# Altium project PCB_Project1.PrjPCB
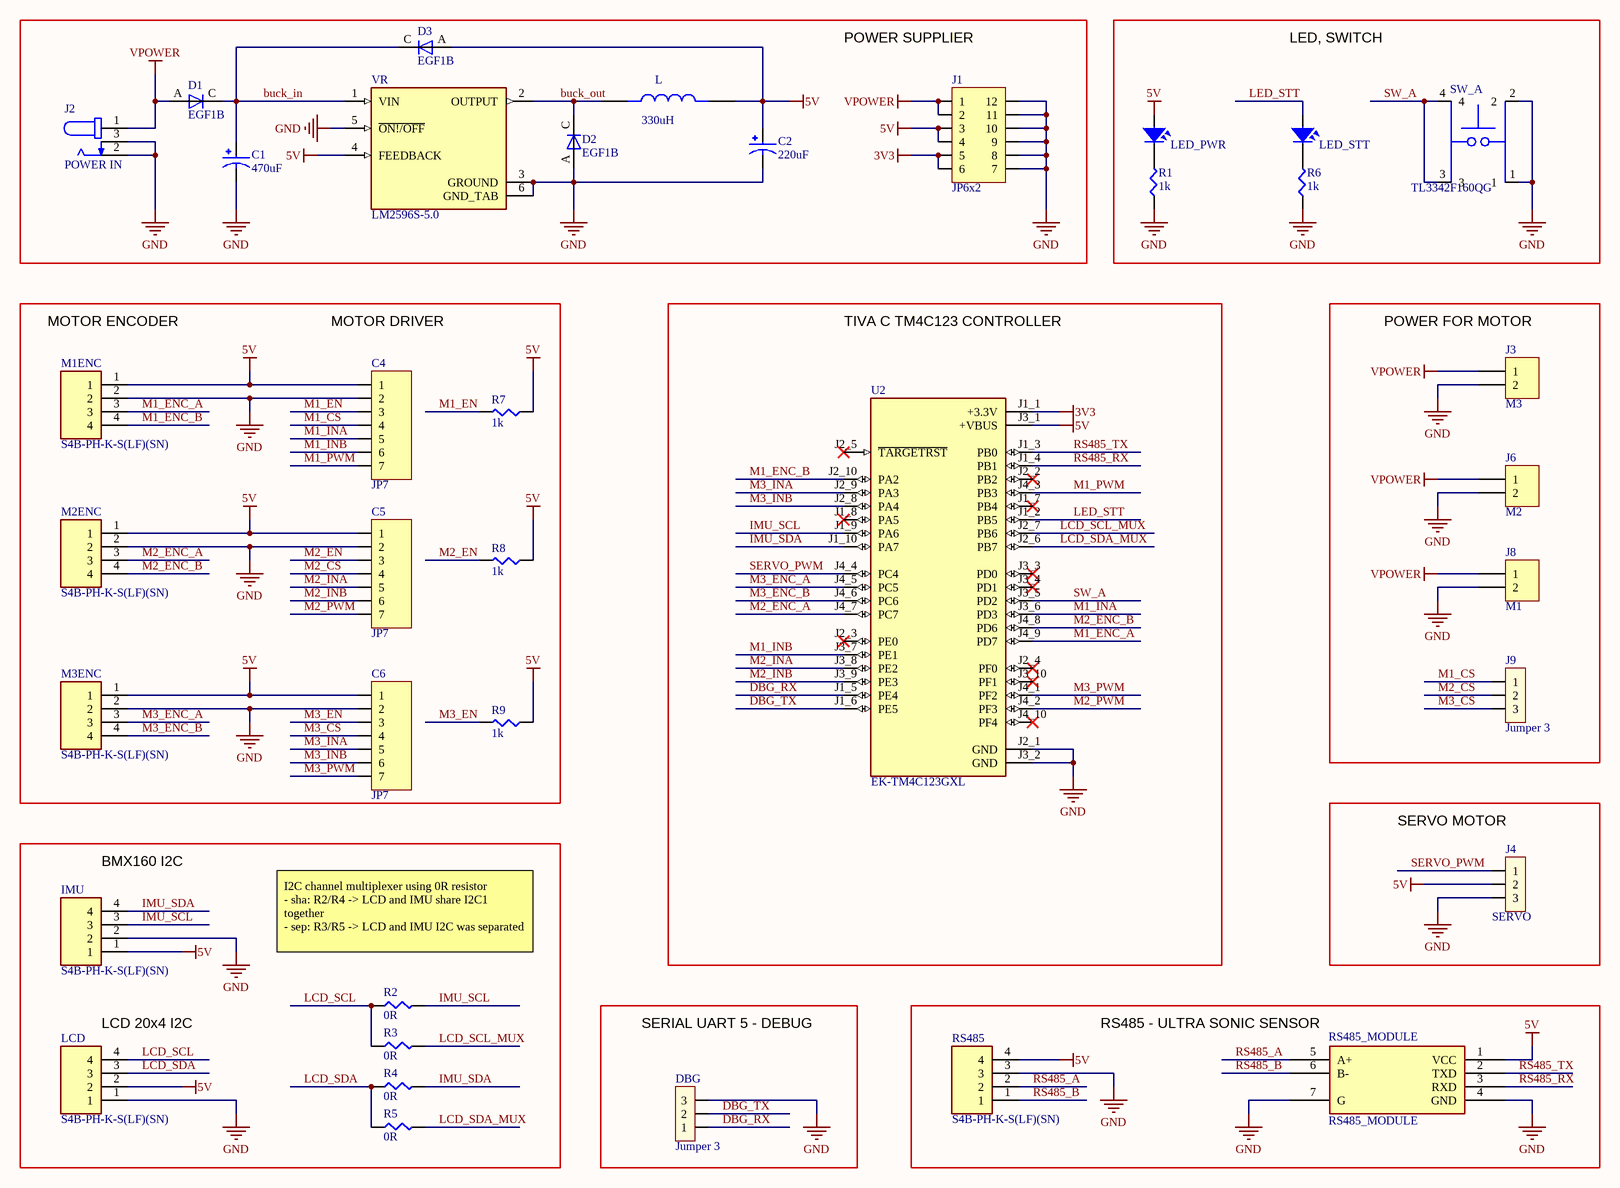
[diagram p0: Sheet1.SchDoc]
1 sheet, 38 parts. Net scope: global (net labels, ports and power ports of the same name join across sheets).
Board file: PCB1.PcbDoc

## Sheet Sheet1.SchDoc: Nexus Robot Controller board
size A3; Author: Khue HM; Address1: Version 1.1; Address2: Design by DPEE Lab; SheetNumber: 1; SheetTotal: 1

### Parts
C1  470uF  [CAP_EEE2AA220P]
C2  220uF  [CAP_EEEHB1V220P]
C4  JP7  [JP7-C1T]
C5  JP7  [JP7-C1T]
C6  JP7  [JP7-C1T]
D1  EGF1B  [DIOM449X264X300L114X135N]
D2  EGF1B  [DIOM449X264X300L114X135N]
D3  EGF1B  [DIOM449X264X300L114X135N]
DBG  Jumper 3  [JP3]
IMU  S4B-PH-K-S(LF)(SN)  [JST_S4B-PH-K-S(LF)(SN)]
J1  JP6x2  [JP6-D2T]
J2  POWER IN  [CUI_PJ-002B]
J3  M3  [KF2-3.5]
J4  SERVO  [JP3]
J6  M2  [KF2-3.5]
J8  M1  [KF2-3.5]
J9  Jumper 3  [JP3]
L  330uH  [IND_B1047AS-331M=P3]
LCD  S4B-PH-K-S(LF)(SN)  [JST_S4B-PH-K-S(LF)(SN)]
LED_PWR  PWR LED  [LED-0805-Green]  (value not drawn)
LED_STT  LED  [LED-0805-Green]  (value not drawn)
M1ENC  S4B-PH-K-S(LF)(SN)  [JST_S4B-PH-K-S(LF)(SN)]
M2ENC  S4B-PH-K-S(LF)(SN)  [JST_S4B-PH-K-S(LF)(SN)]
M3ENC  S4B-PH-K-S(LF)(SN)  [JST_S4B-PH-K-S(LF)(SN)]
R1  1k  [SMD-0805-RES]
R2  0R  [SMD-0805-RES]
R3  0R  [SMD-0805-RES]
R4  0R  [SMD-0805-RES]
R5  0R  [SMD-0805-RES]
R6  1k  [SMD-0805-RES]
R7  1k  [SMD-0805-RES]
R8  1k  [SMD-0805-RES]
R9  1k  [SMD-0805-RES]
RS485  S4B-PH-K-S(LF)(SN)  [JST_S4B-PH-K-S(LF)(SN)]
RS485_MODULE  RS485_MODULE  [RS485_MODULE]
SW_A  TL3342F160QG  [SW_TL3342F160QG]
U2  EK-TM4C123GXL  [MODULE_EK-TM4C123GXL]
VR  LM2596S-5.0  [TO170P1524X483-6N]

### Blocks framed on the sheet
POWER SUPPLIER: C1 C2 D1-D3 J1 J2 L VR
LED, SWITCH: LED_PWR LED_STT R1 R6 SW_A
TIVA C TM4C123 CONTROLLER: U2
POWER FOR MOTOR: J3 J6 J8 J9
SERVO MOTOR: J4
SERIAL UART 5 - DEBUG: DBG
RS485 - ULTRA SONIC SENSOR: RS485 RS485_MODULE

### Nets
3V3: J1.5 J1.6 U2.J1_1(+3.3V)
5V: C2.1 C4.1 C5.1 C6.1 D3.A IMU.1 J1.3 J1.4 J4.2 L.2 LCD.2 LED_PWR.1 M1ENC.1 M2ENC.1 M3ENC.1 R7.1 R8.1 R9.1 RS485.4 RS485_MODULE.1(VCC) U2.J3_1(+VBUS) VR.4(FEEDBACK)
GND: C1.2 C2.2 C4.2 C5.2 C6.2 D2.A DBG.3 IMU.2 J1.7 J1.8 J1.9 J1.10 J1.11 J1.12 J2.2 J2.3 J3.2 J4.3 J6.2 J8.2 LCD.1 M1ENC.2 M2ENC.2 M3ENC.2 R1.1 R6.1 RS485.3 RS485_MODULE.4(GND) RS485_MODULE.7(G) SW_A.1 SW_A.2 U2.J2_1(GND) U2.J3_2(GND) VR.3(GROUND) VR.5(~{ON!/OFF}) VR.6(GND_TAB)
VPOWER: D1.A J1.1 J1.2 J2.1 J3.1 J6.1 J8.1
buck_in: C1.1 D1.C D3.C VR.1(VIN)
buck_out: D2.C L.1 VR.2(OUTPUT)
DBG_RX: DBG.1 U2.J1_5(PE4)
DBG_TX: DBG.2 U2.J1_6(PE5)
IMU_SCL: IMU.3 R2.2 U2.J1_9(PA6)
IMU_SDA: IMU.4 R4.2 U2.J1_10(PA7)
LCD_SCL: LCD.4 R2.1 R3.1
LCD_SCL_MUX: R3.2 U2.J2_7(PB6)
LCD_SDA: LCD.3 R4.1 R5.1
LCD_SDA_MUX: R5.2 U2.J2_6(PB7)
LED_STT: LED_STT.1 U2.J1_2(PB5)
M1_CS: C4.4 J9.1
M1_EN: C4.3 R7.2
M1_ENC_A: M1ENC.3 U2.J4_9(PD7)
M1_ENC_B: M1ENC.4 U2.J2_10(PA2)
M1_INA: C4.5 U2.J3_6(PD3)
M1_INB: C4.6 U2.J3_7(PE1)
M1_PWM: C4.7 U2.J4_3(PB3)
M2_CS: C5.4 J9.2
M2_EN: C5.3 R8.2
M2_ENC_A: M2ENC.3 U2.J4_7(PC7)
M2_ENC_B: M2ENC.4 U2.J4_8(PD6)
M2_INA: C5.5 U2.J3_8(PE2)
M2_INB: C5.6 U2.J3_9(PE3)
M2_PWM: C5.7 U2.J4_2(PF3)
M3_CS: C6.4 J9.3
M3_EN: C6.3 R9.2
M3_ENC_A: M3ENC.3 U2.J4_5(PC5)
M3_ENC_B: M3ENC.4 U2.J4_6(PC6)
M3_INA: C6.5 U2.J2_9(PA3)
M3_INB: C6.6 U2.J2_8(PA4)
M3_PWM: C6.7 U2.J4_1(PF2)
RS485_A: RS485.2 RS485_MODULE.5(A+)
RS485_B: RS485.1 RS485_MODULE.6(B-)
RS485_RX: RS485_MODULE.3(RXD) U2.J1_4(PB1)
RS485_TX: RS485_MODULE.2(TXD) U2.J1_3(PB0)
SERVO_PWM: J4.1 U2.J4_4(PC4)
SW_A: SW_A.3 SW_A.4 U2.J3_5(PD2)
NetLED_PWR_2: LED_PWR.2 R1.2
NetLED_STT_2: LED_STT.2 R6.2

Not connected (* = marked no-connect by the designer): U2 J1_7(PB4)* J1_8(PA5)* J2_2(PB2)* J2_3(PE0)* J2_4(PF0)* J2_5(~{TARGETRST})* J3_3(PD0)* J3_4(PD1)* J3_10(PF1)* J4_10(PF4)*

### Notes on the sheet
- MOTOR ENCODER
- MOTOR DRIVER
- (near IMU) BMX160 I2C
- I2C channel multiplexer using 0R resistor
  - sha: R2/R4 -> LCD and IMU share I2C1 together
  - sep: R3/R5 -> LCD and IMU I2C was separated
- (near LCD) LCD 20x4 I2C
- Title
- Size:
- Date:
- A3
- Number:
- Time:
- Revision:
- Sheet
- of
- File:

### Library data of the parts
C1 = EEE2AA220P: Capacitor; Alum Electrolytic; Cap 22 uF; Tol 20%; Vol-Rtg 100 VDC; SMT; 10x10.5; TR; MF: Panasonic; MP: EEE-2AA220P; Availability: In Stock; Price: None; SnapEDA_Link: https://www.snapeda.com/parts/EEE-2AA220P/Panasonic/view-part/865126/?ref=snap; Value: *; Check_prices: https://www.snapeda.com/parts/EEE-2AA220P/Panasonic/view-part/865126/?ref=eda; Package: RADIAL-2 Panasonic
C2 = EEEHB1V220P: EEE-HB Series 35 V 22 uF Ã˜ 6.3 x 5.8 mm 105 Â°C SMT V-Chip Aluminum Electrolytic; MF: Panasonic; Price: None; SnapEDA_Link: https://www.snapeda.com/parts/EEEHB1V220P/Panasonic/view-part/?ref=snap; Purchase-URL: https://pricing.snapeda.com/search/part/EEEHB1V220P/?ref=eda; MP: EEEHB1V220P; Value: *; Availability: In Stock; Package: RADIAL-2 Panasonic; Check_prices: https://www.snapeda.com/parts/EEEHB1V220P/Panasonic/view-part/?ref=eda
C4-C6 = JP7_1: WR-PHD 2.54 mm Angled Socket Header; Manufacturer: W¨¹rth Elektronik eiSos GmbH; partNo: 613007143121; ComponentLink1 Description: Manufacturer; ComponentLink2 Description: Datasheet; NoPins: 07; Created Date: 29 March 2013; ComponentLink1URL: http://www.we-online.com; ComponentLink2URL: http://katalog.we-online.de/em/datasheet/6130xx143121.pdf; Created by: Karrer Zheng
D1-D3 = EGF1B: SS54 SMA / Diode Shotky SS54 1N5824 5A 40V; MF: ON Semiconductor; Package: DO-214AC-214 ON Semiconductor; Value: *; MP: EGF1B; Availability: Unavailable; SnapEDA_Link: https://www.snapeda.com/parts/EGF1B/ON%20Semiconductor/view-part/1790489/?ref=snap; Price: None
DBG J4 J9 = JP3: Value: J3
IMU LCD M1ENC M2ENC M3ENC RS485 = S4B-PH-K-S(LF)(SN): Connector Header Through Hole, Right Angle 4 position 0.079 _2.00mm_; MP: S4B-PH-K-S_LF__SN_; MF: JST Sales; Price: None; Package: None; Value: *; Availability: Unavailable; SnapEDA_Link: https://www.snapeda.com/parts/S4B-PH-K-S%28LF%29%28SN%29/JST%20Sales%20America%20Inc./view-part/591324/?ref=snap
J1 = JP6x2: WR-PHD 2.54 mm Dual Socket Header; Manufacturer: W¨¹rth Elektronik eiSos GmbH; partNo: 61301221821; ComponentLink1 Description: Manufacturer; ComponentLink2 Description: Datasheet; NoPins: 12; Created Date: 29 March 2013; ComponentLink1URL: http://www.we-online.com; ComponentLink2URL: http://katalog.we-online.de/em/datasheet/6130xx21821.pdf; Created by: Karrer Zheng
J2 = PJ-002B: 2.5 x 6.5 mm, 2.5 A, Horizontal, Through Hole, Dc Power Jack Connector; MF: CUI Devices; Price: None; Availability: Unavailable; Value: *; SnapEDA_Link: https://www.snapeda.com/parts/PJ-002B/CUI%20Devices/view-part/697203/?ref=snap; MP: PJ-002B; Package: None; CUI_purchase_URL: https://www.cuidevices.com/product/interconnect/connectors/dc-power-connectors/jacks/pj-002b?utm_source=snapeda.com&utm_medium=referral&utm_campaign=snapedaBOM
J3 J6 J8 = KF2: Manufacturer: Würth Elektronik eiSos GmbH; partNo: 691103110002; ComponentLink1 Description: Manufacturer; ComponentLink2 Description: Datasheet; NoPins: 2; Created Date: 29 October 2013; ComponentLink1URL: http://www.we-online.com; ComponentLink2URL: http://katalog.we-online.de/em/datasheet/6911031100xx.pdf; Created by: Karrer Zheng
L = B1047AS-331M=P3: Inductor with Inductance: 330uH Tol. +/-20%, Package: 2929 (7373); MF: Murata; Availability: Unavailable; Value: *; Arrow_Electronics-Purchase-URL: https://snapeda.com/shop?store=Arrow+Electronics&id=1412841; Price: None; Mouser-Purchase-URL: https://snapeda.com/shop?store=Mouser&id=1412841; SnapEDA_Link: https://www.snapeda.com/parts/B1047AS-331M=P3/Murata/view-part/1412841/?ref=snap; MP: B1047AS-331M=P3; Package: NONSTANDARD
LED_PWR LED_STT = LED SMD: Value: LED 3 - 5 ly 2 Colour
R1-R9 = Res SMD 0805: Part Number: ERJ-S6SJR20V; Manufacturer: Panasonic Electronic Components; Factory Stock: 0; Unit Price (USD): 0.07603; @ qty: 1500; Minimum Quantity: 1; Value: 0.2; Tolerance: ±5%; Power (Watts): 0.25W, 1/4W; Temperature Coefficient: ±150ppm/°C; Datasheets: https://industrial.panasonic.com/cdbs/www-data/pdf/RDA0000/AOA0000CE5.pdf; Image: //media.digikey.com/Renders/Panasonic%20Renders/ERJ-0805%20Pkg.jpg; Digi-Key Part Number: P.2BKCT-ND; Quantity Available: 14281; Packaging: Cut Tape (CT); Series: ERJ; Part Status: Active; Composition: Thick Film; Features: Anti-Sulfur, Automotive AEC-Q200; Operating Temperature: -55°C ~ 155°C; Package / Case: 0805 (2012 Metric); Supplier Device Package: 0805; Size / Dimension: 0.079" L x 0.049" W (2.00mm x 1.25mm); Height - Seated (Max): 0.026" (0.65mm); Number of Terminations: 2; Failure Rate: -
SW_A = TL3342F160QG: Tactile Switch SPST-NO Top Actuated Surface Mount; MF: E-Switch; Package: None; Availability: Unavailable; SnapEDA_Link: https://www.snapeda.com/parts/TL3342F160QG/E-Switch/view-part/1099729/?ref=snap; MP: TL3342F160QG; Value: *; Price: None
U2 = EK-TM4C123GXL: ARMÂ® CortexÂ®-M4F Based MCU TM4C123G LaunchPadâ„¢ Evaluation Kit; MF: Texas Instruments; Price: None; Package: None; Purchase-URL: https://pricing.snapeda.com/search/part/EK-TM4C123GXL/?ref=eda; MP: EK-TM4C123GXL; Availability: Warning; SnapEDA_Link: https://www.snapeda.com/parts/EK-TM4C123GXL/Texas%20Instruments/view-part/132968/?ref=snap; Check_prices: https://www.snapeda.com/parts/EK-TM4C123GXL/Texas%20Instruments/view-part/132968/?ref=eda; Value: *
VR = LM2596S-5.0: SIMPLE SWITCHER&reg; 4.5V to 40V, 3A Low Component Count Step-Down Regulator 5-DDPAK/TO-263; MF: Texas Instruments; MP: LM2596S-5.0/NOPB; DigiKey-Purchase-URL: https://snapeda.com/shop?store=DigiKey&id=15588; Mouser-Purchase-URL: https://snapeda.com/shop?store=Mouser&id=15588; SnapEDA_Link: https://www.snapeda.com/parts/LM2596S-5.0/NOPB/Texas%20Instruments/view-part/15588/?ref=snap; Price: None; Value: *; Availability: Good; Texas_Instruments-Purchase-URL: https://snapeda.com/shop?store=Texas+Instruments&id=15588; Package: TO-263-5 Texas Instruments